# Altium project usbToTTLByPL2303_6.PrjPcb
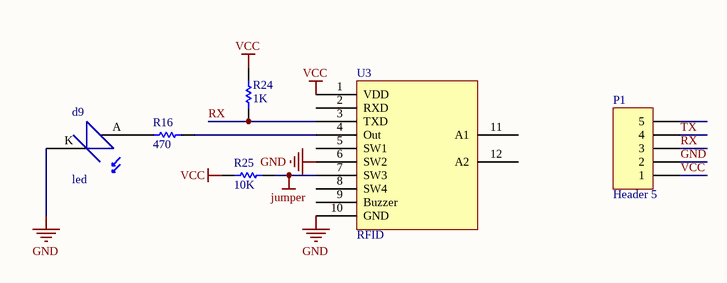
[diagram p0: usbToTTLByPL2303_6.SchDoc]
1 sheet, 6 parts. Net scope: global (net labels, ports and power ports of the same name join across sheets).
Board file: usbToTTLByPL2303_6.PcbDoc

## Sheet usbToTTLByPL2303_6.SchDoc
size A

### Parts
d9  led  [LED5]
P1  Header 5  [HDR1X5]
R16  470  [1206_smd]
R24  1K  [1206_smd]
R25  10K  [1206_smd]
U3  RFID  [rf]

### Nets
GND: d9.K P1.2 U3.6(SW2) U3.10(GND)
jumper: R25.1 U3.7(SW3)
VCC: P1.1 R24.2 R25.2 U3.1(VDD)
RX: P1.3 R24.1 U3.3(TXD)
TX: P1.4
Netd9_A: d9.A R16.1
NetR16_2: R16.2 U3.4(Out)

Not connected (* = marked no-connect by the designer): P1 5; U3 2(RXD) 5(SW1) 8(SW4) 9(Buzzer) 11(A1) 12(A2)

### Library data of the parts
P1 = Header 5: Header, 5-Pin; LatestRevisionDate: 17-Jul-2002; LatestRevisionNote: Re-released for DXP Platform.; Publisher: Altium Limited
R16 R24 R25 = Res1: Resistor; Value: 4.7K; Published: 8-Jun-2000; LatestRevisionDate: 17-Jul-2002; LatestRevisionNote: Re-released for DXP Platform.; PackageReference: AXIAL-0.3; Publisher: Altium Limited
U3 = RFID module